# EAGLE design PrimalLogger_Feather_TalonPlug (EAGLE 9.6.2)
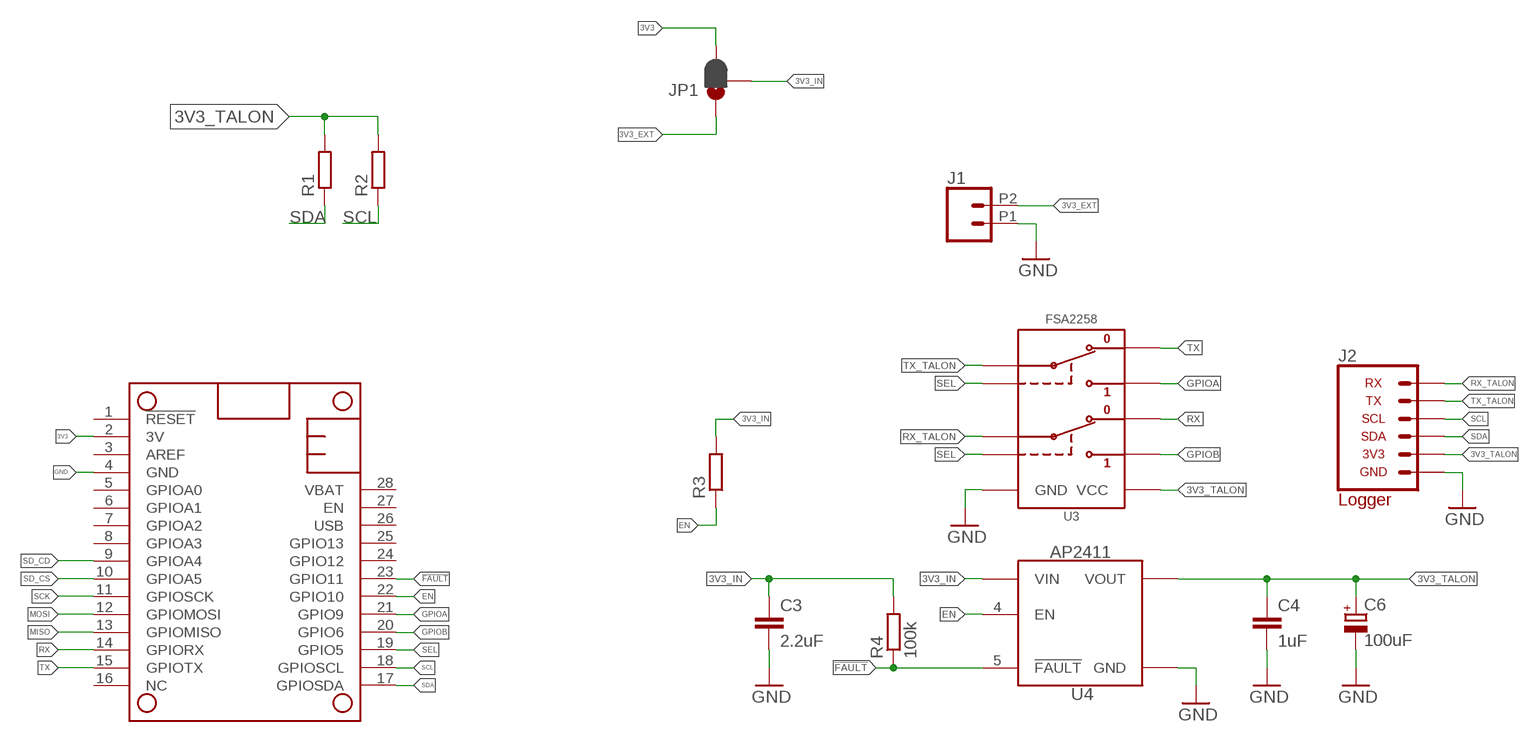
[diagram p0: schematic, sheet 1]

## Parts
C3  2.2uF  C-EU2.2UFC0603  [C0603]
C4  1uF  C-EU1UFC0603  [C0603]
C6  100uF  CTANT_EU1411  [C1411_TANT]
J1  CONN_022.54_SCREW_ROUND  [1X02_2.54_SCREWTERM_ROUND]
J2  CONN_TALON_LOGGER  [1X06_MICROLOCKPLUS_RT]
JP1  JUMPER-SMT_3_1-NC_PASTE_SILK  [SMT-JUMPER_3_1-NC_PASTE_SILK]
MS1  FEATHERWING_NODIM  [FEATHERWING_DIM]
R1  R-EU_10KR0603  [R0603]
R2  R-EU_10KR0603  [R0603]
R3  R-EU_100KR0603  [R0603]
R4  100k  R-EU_100KR0603  [R0603]
U3  FSA2258  [MICROPAK_10]
U4  AP2411  [MSOP_8EP]

## Nets
3V3: JP1.3 MS1.2(3V)
3V3_EXT: J1.P2 JP1.1
3V3_IN: C3.1 JP1.2 R3.2 R4.2 U4.2(VIN) U4.3(VIN)
3V3_TALON: C4.1 C6.ANODE(+) J2.2(3V3) R1.2 R2.2 U3.10(VCC) U4.6(VOUT) U4.7(VOUT)
!FAULT: MS1.23(GPIO11) R4.1 U4.5(!FAULT)
EN: MS1.22(GPIO10) R3.1 U4.4(EN)
GND: C3.2 C4.2 C6.CATHODE(-) J1.P1 J2.1(GND) MS1.4(GND) U3.5(GND) U4.1(GND) U4.EP(GND)
GPIOA: MS1.21(GPIO9) U3.2(1B1)
GPIOB: MS1.20(GPIO6) U3.4(2B1)
MISO: MS1.13(GPIOMISO)
MOSI: MS1.12(GPIOMOSI)
RX: MS1.14(GPIORX) U3.3(2B0)
RX_TALON: J2.6(RX) U3.6(2A)
SCK: MS1.11(GPIOSCK)
SCL: J2.4(SCL) MS1.18(GPIOSCL) R2.1
SD_CD: MS1.9(GPIOA4)
SD_CS: MS1.10(GPIOA5)
SDA: J2.3(SDA) MS1.17(GPIOSDA) R1.1
SEL: MS1.19(GPIO5) U3.7(S2) U3.8(S1)
TX: MS1.15(GPIOTX) U3.1(1B0)
TX_TALON: J2.5(TX) U3.9(1A)
Unconnected: MS1.1(!RESET) MS1.3(AREF) MS1.5(GPIOA0) MS1.6(GPIOA1) MS1.7(GPIOA2) MS1.8(GPIOA3) MS1.16(NC) MS1.24(GPIO12) MS1.25(GPIO13) MS1.26(USB) MS1.27(EN) MS1.28(VBAT)

## Library data of the parts
C3 = bschulz_passives:C-EU: CAPACITOR, European symbol; DIGIKEY: 1276-1183-1-ND; MF: Samsung; MPN: CL10A225KQ8NNNC
C4 = bschulz_passives:C-EU: CAPACITOR, European symbol; DIGIKEY: 587-1251-1-ND; MF: Yaiyo Yuden; MPN: EMK107BJ105KA-T
C6 = bschulz_passives:CTANT_EU: Genaric Tantalum Capacitor; DIGIKEY: 478-5231-1-ND; MF: Kyocera AVX; MPN: TPSB107M010R0400
J1 = bschulz:CONN_02: Genaric 2 terminal header SCREW_2.54 <https://www.digikey.com/product-detail/en/on-shore-technology-inc/OSTVN02A150/ED10561-ND/1588862> 39532_RA <https://www.digikey.com/product-detail/en/molex/0395321002/WM7845-ND/1280696>; DIGIKEY: ED10561-ND; MF: OnShore; MPN: OSTVN02A150
J2 = GEMS_Plugs:CONN_TALON: GEMS Connector for Talon Interface; DIGIKEY: WM22471CT-ND; DISP: Logger; MF: Molex; MPN: 5055670681
JP1 = bschulz:JUMPER-SMT_3_1-NC_PASTE: Normally closed solder jumper (1 of 2 connections) This jumper has an aperture in the stencil to allow solder paste to bridge one of the two connections. One connection is normally closed (NC), while the other is normally open (NO). Wick off the solder to open the connection. Reapply solder to reclose the connection. Apply solder to the other side instead to change the current path.; DIGIKEY: DNP; MF: N/A; MPN: N/A
MS1 = bschulz:FEATHERWING
R1 R2 = bschulz_passives:R-EU_: RESISTOR, European symbol Digikey Parts: Yageo, 0402 <https://www.digikey.com/products/en/resistors/chip-resistor-surface-mount/52?k=&pkeyword=&sv=0&s=4356&sf=1&FV=-1%7C13%2C7%7C2%2C1291%7C39157%2C1989%7C0%2C-8%7C52%2C3%7C1131%2C3%7C2503&quantity=&ColumnSort=0&page=1&stock=1&pageSize=25> Yageo, 0603 <https://www.digikey.com/products/en/resistors/chip-resistor-surface-mount/52?k=&pkeyword=&sv=0&pv1291=39245&sf=1&FV=-5%7C4356%2C-5%7C47360%2C-8%7C52%2C-1%7C13%2C7%7C2%2C1989%7C0&quantity=10&ColumnSort=1000011&page=1&stock=1&pageSize=25> Panasonic, 0603 <https://www.digikey.com/products/en/resistors/chip-resistor-surface-mount/52?k=&pkeyword=&pv252=68&sf=0&FV=ffec373d%2C1c0002%2C142c040c%2C1f140000%2Cffe00034%2C80002%2Cc0001&quantity=&ColumnSort=0&page=1&stock=1&pageSize=25> Panasonic, precision, 0603 <https://www.digikey.com/products/en/resistors/chip-resistor-surface-mount/52?FV=ffec4907%2Cfffc000a%2Cc0172%2C142c040c%2C1f140000%2Cffe00034%2C1c0002&quantity=100&ColumnSort=2085&page=1&stock=1&pageSize=25> Panasonic, 0805 <https://www.digikey.com/products/en/resistors/chip-resistor-surface-mount/52?k=&pkeyword=&pv3=1&sf=0&FV=ffec373d%2C1c0002%2C1f140000%2Cffe00034%2C142c040d&quantity=&ColumnSort=0&page=1&stock=1&pageSize=25> Rohm, current sense <https://www.digikey.com/products/en/resistors/chip-resistor-surface-mount/52?k=&pkeyword=&pv3=1&sf=0&FV=ffecb688%2C1f140000%2Cffe00034%2C1c0002&quantity=&ColumnSort=0&page=1&stock=1&pageSize=25> Vishay, pulse proof automotive <https://www.digikey.com/products/en/resistors/chip-resistor-surface-mount/52?k=&pkeyword=&pv7=2&sf=0&FV=ffec5d6b%2Cffe00034%2C1f140000&quantity=&ColumnSort=0&page=1&stock=1&pageSize=25>; DIGIKEY: 311-10.0KHRCT-ND; MF: Yageo; MPN: RC0603FR-0710KL; VALUE_PART: 10k
R3 R4 = bschulz_passives:R-EU_: RESISTOR, European symbol Digikey Parts: Yageo, 0402 <https://www.digikey.com/products/en/resistors/chip-resistor-surface-mount/52?k=&pkeyword=&sv=0&s=4356&sf=1&FV=-1%7C13%2C7%7C2%2C1291%7C39157%2C1989%7C0%2C-8%7C52%2C3%7C1131%2C3%7C2503&quantity=&ColumnSort=0&page=1&stock=1&pageSize=25> Yageo, 0603 <https://www.digikey.com/products/en/resistors/chip-resistor-surface-mount/52?k=&pkeyword=&sv=0&pv1291=39245&sf=1&FV=-5%7C4356%2C-5%7C47360%2C-8%7C52%2C-1%7C13%2C7%7C2%2C1989%7C0&quantity=10&ColumnSort=1000011&page=1&stock=1&pageSize=25> Panasonic, 0603 <https://www.digikey.com/products/en/resistors/chip-resistor-surface-mount/52?k=&pkeyword=&pv252=68&sf=0&FV=ffec373d%2C1c0002%2C142c040c%2C1f140000%2Cffe00034%2C80002%2Cc0001&quantity=&ColumnSort=0&page=1&stock=1&pageSize=25> Panasonic, precision, 0603 <https://www.digikey.com/products/en/resistors/chip-resistor-surface-mount/52?FV=ffec4907%2Cfffc000a%2Cc0172%2C142c040c%2C1f140000%2Cffe00034%2C1c0002&quantity=100&ColumnSort=2085&page=1&stock=1&pageSize=25> Panasonic, 0805 <https://www.digikey.com/products/en/resistors/chip-resistor-surface-mount/52?k=&pkeyword=&pv3=1&sf=0&FV=ffec373d%2C1c0002%2C1f140000%2Cffe00034%2C142c040d&quantity=&ColumnSort=0&page=1&stock=1&pageSize=25> Rohm, current sense <https://www.digikey.com/products/en/resistors/chip-resistor-surface-mount/52?k=&pkeyword=&pv3=1&sf=0&FV=ffecb688%2C1f140000%2Cffe00034%2C1c0002&quantity=&ColumnSort=0&page=1&stock=1&pageSize=25> Vishay, pulse proof automotive <https://www.digikey.com/products/en/resistors/chip-resistor-surface-mount/52?k=&pkeyword=&pv7=2&sf=0&FV=ffec5d6b%2Cffe00034%2C1f140000&quantity=&ColumnSort=0&page=1&stock=1&pageSize=25>; DIGIKEY: 311-100KHRCT-ND; MF: Yageo; MPN: RC0603FR-07100KL; VALUE_PART: 100k
U3 = bschulz:FSA2258: FSA2258 - Low Voltage, Dual SPDT Analog Switch Characteristics: VCC: 1.65~4.3V On state resistace: 0.8 Ω, Max Channel to Channel Matching: 0.2 Ω, Typical Operating Temperature: -40°C to 85°C Digikey: FSA2258L10XCT-ND <https://www.digikey.com/en/products/detail/onsemi/FSA2258L10X/2115881>; DIGIKEY: FSA2258L10XCT-ND; DISP: FSA2258; MF: OnSemi; MPN: FSA2258L10X
U4 = bschulz:AP24*1: AP24x1 - Current Limit Load Switch with Latch-Off Characteristics: Vin: 2.7V ~ 5.5V IQ: 0.1μA (OFF), 60μA (ON) RDS(ON): 70mΩ (Vin = 5V), 90mΩ (Vin = 3.3V) UVLO: 2V Output Current: 2.5A Operating Temperature: -40°C to 85°C Digikey: AP2411MP-13DICT-ND (MSOP, Active High) <https://www.digikey.com/en/products/detail/diodes-incorporated/AP2411MP-13/2755849>; DIGIKEY: AP2411MP-13DICT-ND; DISP: AP2411; MF: Diodes Inc; MPN: AP2411MP-13

## Board
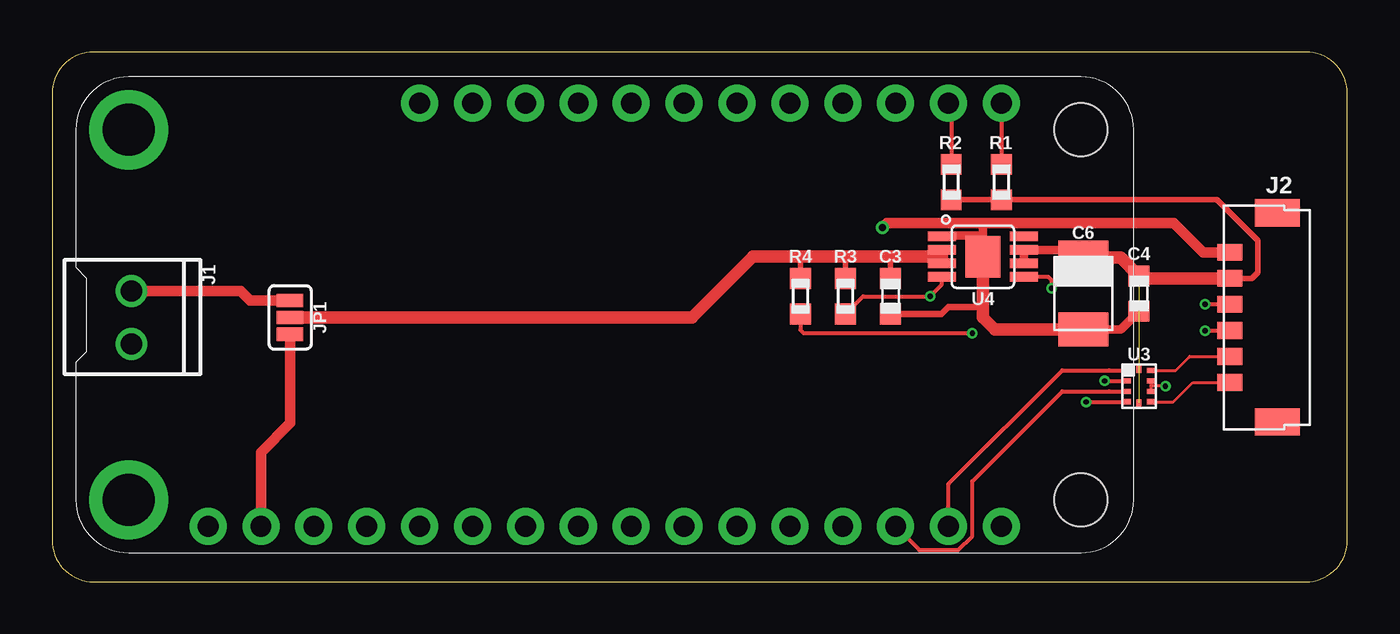
[diagram p1: board, top side]
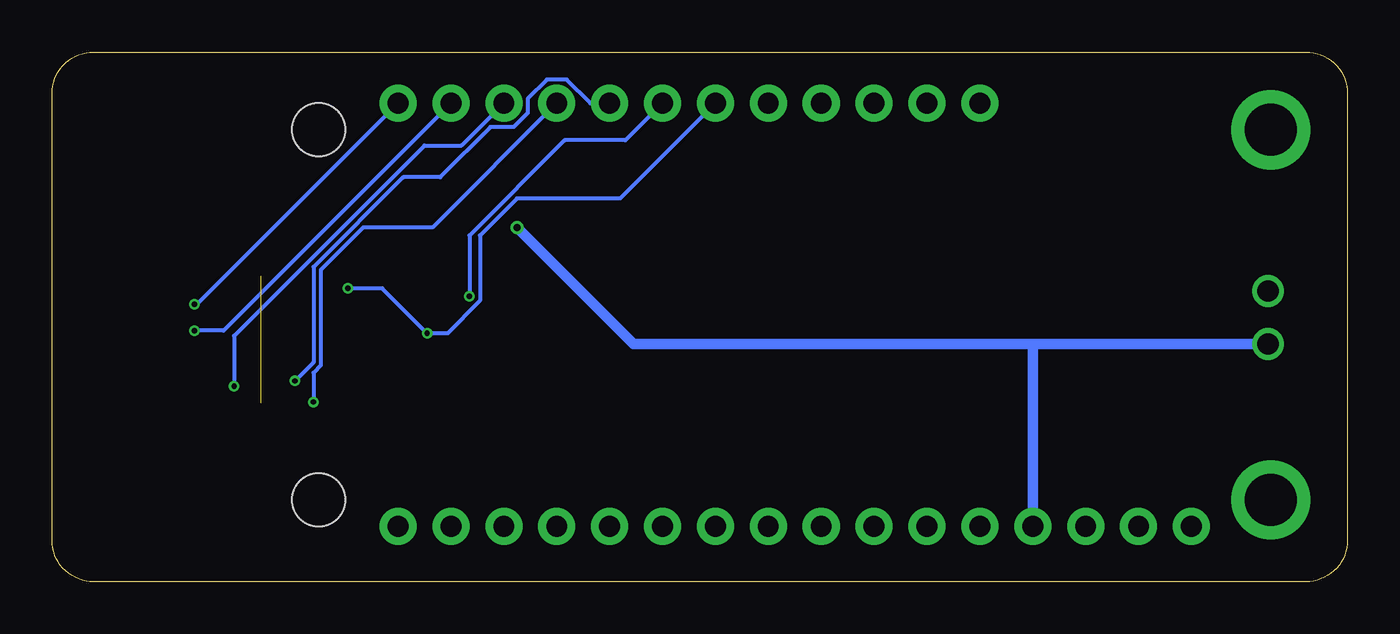
[diagram p2: board, bottom side, seen from below]

Size 62.21 x 25.45 mm. Coordinates in mm from the lower left corner, seen from the top.
Outline: 0,23.45 0,2 arc90 2,0 60.21,0 arc90 62.21,2 62.21,23.45 arc90 60.21,25.45 2,25.45 arc90 0,23.45
Copper layers (1*16): Top 0.035559375mm / dielectric 1.6mm / Bottom 0.035559375mm
Design rules "oshpark-2layer": minimum track width 6mil, minimum drill 10mil, track to track 6mil, track to pad 6mil, pad to pad 6mil, via to via 6mil, smd to smd 6mil, copper to edge 15mil, drill to drill 6mil, minimum pad ring 5mil, minimum via ring 5mil, stop-mask expansion 2.5mil, vias tented up to drill 0mil, thermal gap 10mil

### Footprints (pad centres in the part's own frame; a part is rotated, then mirrored left to right if it is on the bottom)
C0603 = smd 1 x 1: 1 -0.85,0; 2 0.85,0
C1411_TANT = smd 1.65 x 2.4: ANODE -1.725,0; CATHODE 1.725,0
1X02_2.54_SCREWTERM_ROUND = drill 1.016: P1 1.27,0; P2 -1.27,0
1X06_MICROLOCKPLUS_RT = smd 0.8 x 1.2: 1 -3.125,-0.6; 2 -1.875,-0.6; 3 -0.625,-0.6; 4 0.625,-0.6; 5 1.875,-0.6; 6 3.125,-0.6 | smd 1.3 x 2.15: BODY@1 -5.025,1.695; BODY@2 5.025,1.695
SMT-JUMPER_3_1-NC_PASTE_SILK = smd 0.635 x 1.27: 1 -0.813,0; 2 0,0; 3 0.813,0
FEATHERWING_DIM = drill 1 pad 1.778: 1 6.35,1.27; 2 8.89,1.27; 3 11.43,1.27; 4 13.97,1.27; 5 16.51,1.27; 6 19.05,1.27; 7 21.59,1.27; 8 24.13,1.27; 9 26.67,1.27; 10 29.21,1.27; 11 31.75,1.27; 12 34.29,1.27; 13 36.83,1.27; 14 39.37,1.27; 15 41.91,1.27; 16 44.45,1.27; 17 44.45,21.59; 18 41.91,21.59; 19 39.37,21.59; 20 36.83,21.59; 21 34.29,21.59; 22 31.75,21.59; 23 29.21,21.59; 24 26.67,21.59; 25 24.13,21.59; 26 21.59,21.59; 27 19.05,21.59; 28 16.51,21.59 | drill 2.5 pad 3.81: P$1 2.54,20.32; P$2 2.54,2.54 | hole 2.54: 48.26,20.32; 48.26,2.54
R0603 = smd 1 x 1: 1 -0.85,0; 2 0.85,0
MICROPAK_10 = smd 0.25 x 0.35: 1 -0.75,-0.56; 2 -0.25,-0.56; 3 0.25,-0.56; 4 0.75,-0.56; 6 0.75,0.56; 7 0.25,0.56; 8 -0.25,0.56; 9 -0.75,0.56 | smd 0.35 x 0.25: 5 0.81,0; 10 -0.81,0
MSOP_8EP = smd 1.35 x 0.45: 1 -1.975,0.975; 2 -1.975,0.325; 3 -1.975,-0.325; 4 -1.975,-0.975; 5 1.975,-0.975; 6 1.975,-0.325; 7 1.975,0.325; 8 1.975,0.975 | smd 1.7 x 2: EP 0,0

### Placement (x,y rotation side)
C3  40.26,13.72 270 top
C4  52.2,13.84 270 top
C6  49.53,13.84 270 top
J1  3.81,12.7 270 top
J2  57.15,12.7 270 top
JP1  11.43,12.7 270 top
MS1  1.14,1.4 0 top
R1  45.59,19.2 270 top
R2  43.18,19.2 270 top
R3  38.1,13.72 90 top
R4  35.94,13.72 90 top
U3  52.2,9.4 270 top
U4  44.7,15.62 0 top

### Tracks (layer width: path | path; a pad name or v marks a point on that pad's centre or on a via)
3V3
  Top 0.508: MS1.2 10.03,6.22 11.43,7.62 JP1.3
3V3_EXT
  Top 0.508: JP1.1 9.53,13.51 9.07,13.97 J1.P2
3V3_IN
  Top 0.254: R4.2 35.94,15.49 36.07,15.62 | R3.2 38.1,15.62 | C3.1 40.26,15.49 40.13,15.62
  Top 0.406: U4.2 42.73,15.62 U4.3
  Top 0.61: JP1.2 30.73,12.7 33.66,15.62 36.07,15.62 38.1,15.62 40.13,15.62 42.73,15.62
3V3_TALON  (1 unrouted)
  Top 0.254: R2.2 R1.2 55.94,18.35 57.91,16.38 57.91,14.86 57.63,14.57 J2.2
  Top 0.406: U4.6 U4.7 49.15,15.95 C6.ANODE
  Top 0.61: J2.2 52.31,14.57 C4.1 51.32,15.57 C6.ANODE 49.28,15.82
!FAULT  (via drill 0.25)
  Top 0.2: v44.2,11.94 36.11,11.94 35.94,12.1 R4.1 | v48.01,14.1 48.01,14.48 47.84,14.65 U4.5
  Bottom 0.2: v48.01,14.1 46.35,14.1 v44.2,11.94 43.23,11.94 41.66,13.51 41.66,16.64 39.89,18.41 34.92,18.41 MS1.23
EN  (via drill 0.25)
  Top 0.2: R3.1 38.95,13.72 v42.16,13.72 42.73,14.28 U4.4
  Bottom 0.2: MS1.22 34.67,21.21 37.59,21.21 42.16,16.64 v42.16,13.72
GND  (via drill 0.35)  (1 unrouted)
  Top 0.305: C3.2 42.71,12.87 43.05,13.21 44.7,13.21
  Top 0.406: U4.EP 44.7,16.64 | 44.7,16.64 44.7,17.23 | U4.1 42.77,16.64 44.7,16.64 | C6.CATHODE 51.32,12.12 C4.2
  Top 0.508: v39.88,17.02 40.09,17.23 44.7,17.23 53.88,17.23 55.28,15.82 J2.1
  Top 0.61: U4.EP 44.7,13.21 44.7,12.7 45.29,12.12 C6.CATHODE
  Bottom 0.508: J1.P1 15.11,11.43 | 15.11,11.43 34.29,11.43 v39.88,17.02 | MS1.4 15.11,11.43
GPIOA  (via drill 0.25)
  Top 0.2: v50.55,9.65 U3.2
  Bottom 0.2: MS1.21 36.36,22.99 37.5,24.13 38.45,24.13 39.37,23.2 39.37,22.51 40.04,21.85 41.16,21.85 43.57,19.43 45.35,19.43 49.66,15.12 49.66,10.54 v50.55,9.65
GPIOB  (via drill 0.25)
  Top 0.2: v49.66,8.64 v49.67,8.65 U3.4
  Bottom 0.2: v49.66,8.64 49.66,10.04 49.3,10.4 49.3,14.98 47.26,17.02 43.94,17.02 MS1.20
RX
  Top 0.2: MS1.14 41.65,1.53 43.53,1.53 44.19,2.19 44.19,4.82 48.52,9.15 50.76,9.15 U3.3
RX_TALON
  Top 0.152: U3.6 53.86,8.65 54.79,9.57 J2.6
SCL  (via drill 0.25)
  Top 0.2: MS1.18 43.18,22.86 R2.1 | v55.37,12.06 55.38,12.07 J2.4
  Bottom 0.2: MS1.18 53.98,12.06 v55.37,12.06
SDA  (via drill 0.25)
  Top 0.2: MS1.17 R1.1 | v55.37,13.34 56.54,13.34 J2.3
  Bottom 0.2: MS1.17 55.24,13.34 v55.37,13.34
SEL  (via drill 0.25)
  Top 0.152: U3.8 52.76,9.4 | 52.76,9.4 U3.7 | v53.47,9.4 52.76,9.4
  Bottom 0.2: MS1.19 42.55,20.95 44.32,20.95 53.47,11.81 v53.47,9.4
TX
  Top 0.2: MS1.15 43.05,4.7 48.51,10.16 50.76,10.16 50.77,10.15 U3.1
TX_TALON
  Top 0.152: U3.9 53.96,10.15 54.64,10.82 J2.5

### Text on the board
tDocu: Primal / Log / Talon | + | Ext | 3.3V | 3v3 | - | Bobby / Schulz / v0.0